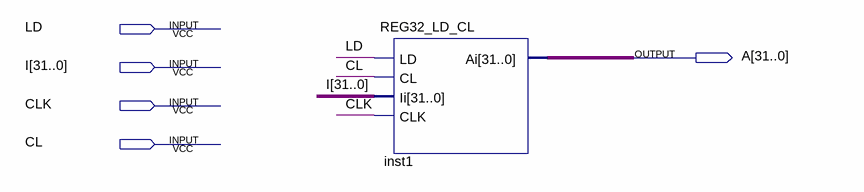
[diagram p0: schematic sheet]
// Quartus schematic MDR.bdf as structural Verilog: 1 symbols, 5 pins
module MDR (
  input  LD,
  input  [31:0] I,
  input  CLK,
  input  CL,
  output [31:0] A
);

  REG32_LD_CL inst1 (.LD(LD), .CL(CL), .Ii(I), .CLK(CLK), .Ai(A));
endmodule
